# EAGLE design Light Sensor (EAGLE 7.2.0)
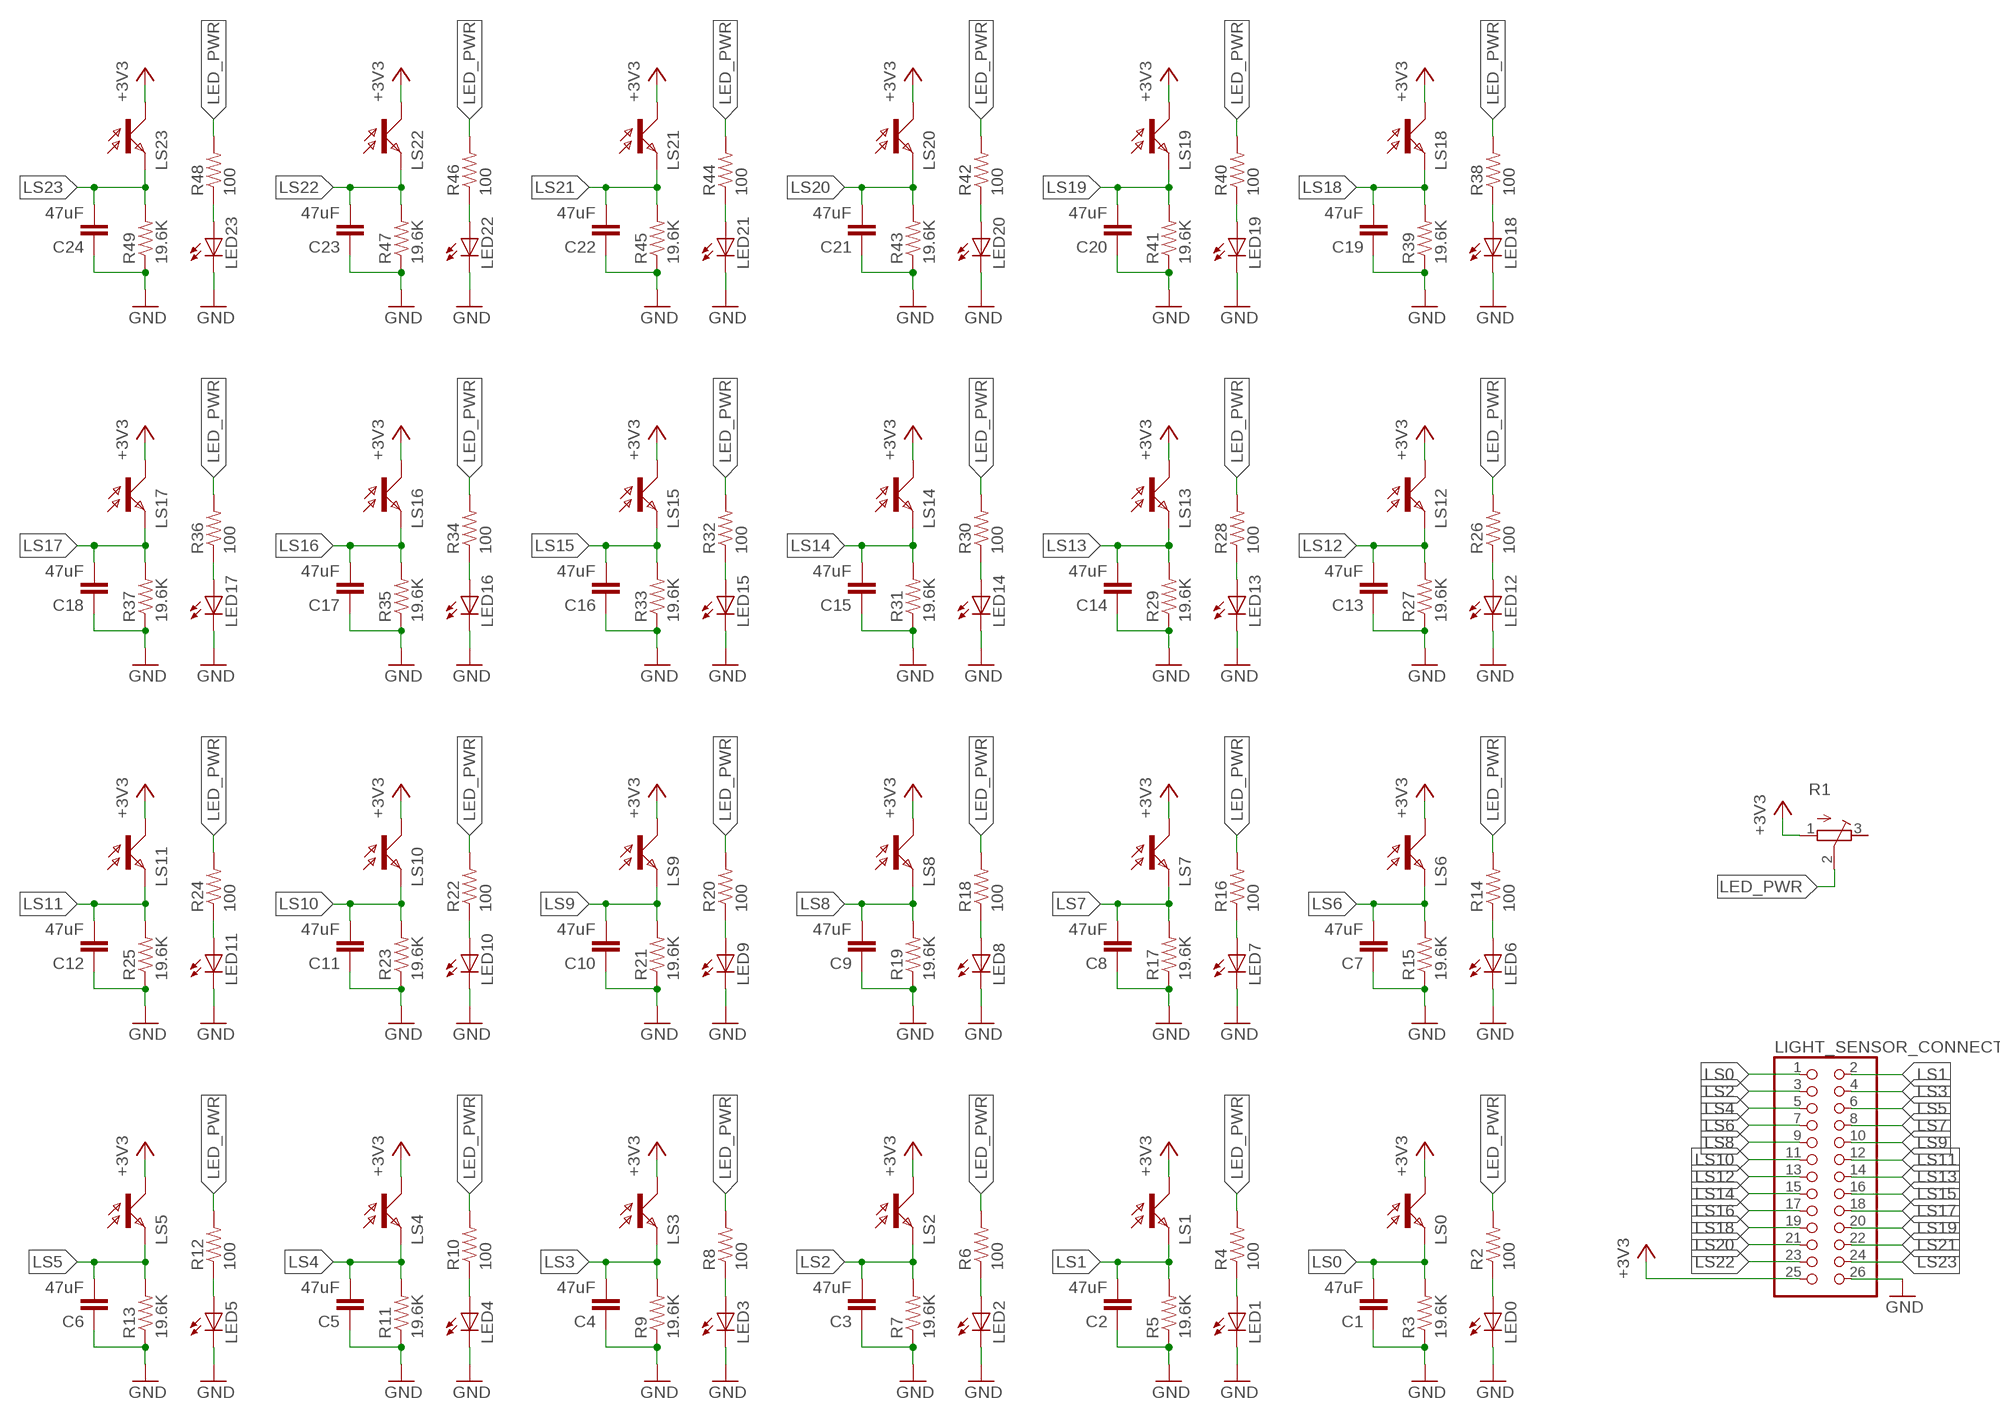
[diagram p0: schematic, sheet 1]

## Parts
C1  47uF  CAP1206  [1206]
C2  47uF  CAP1206  [1206]
C3  47uF  CAP1206  [1206]
C4  47uF  CAP1206  [1206]
C5  47uF  CAP1206  [1206]
C6  47uF  CAP1206  [1206]
C7  47uF  CAP1206  [1206]
C8  47uF  CAP1206  [1206]
C9  47uF  CAP1206  [1206]
C10  47uF  CAP1206  [1206]
C11  47uF  CAP1206  [1206]
C12  47uF  CAP1206  [1206]
C13  47uF  CAP1206  [1206]
C14  47uF  CAP1206  [1206]
C15  47uF  CAP1206  [1206]
C16  47uF  CAP1206  [1206]
C17  47uF  CAP1206  [1206]
C18  47uF  CAP1206  [1206]
C19  47uF  CAP1206  [1206]
C20  47uF  CAP1206  [1206]
C21  47uF  CAP1206  [1206]
C22  47uF  CAP1206  [1206]
C23  47uF  CAP1206  [1206]
C24  47uF  CAP1206  [1206]
LED0  LEDCHIP-LED0603  [CHIP-LED0603]
LED1  LEDCHIP-LED0603  [CHIP-LED0603]
LED2  LEDCHIP-LED0603  [CHIP-LED0603]
LED3  LEDCHIP-LED0603  [CHIP-LED0603]
LED4  LEDCHIP-LED0603  [CHIP-LED0603]
LED5  LEDCHIP-LED0603  [CHIP-LED0603]
LED6  LEDCHIP-LED0603  [CHIP-LED0603]
LED7  LEDCHIP-LED0603  [CHIP-LED0603]
LED8  LEDCHIP-LED0603  [CHIP-LED0603]
LED9  LEDCHIP-LED0603  [CHIP-LED0603]
LED10  LEDCHIP-LED0603  [CHIP-LED0603]
LED11  LEDCHIP-LED0603  [CHIP-LED0603]
LED12  LEDCHIP-LED0603  [CHIP-LED0603]
LED13  LEDCHIP-LED0603  [CHIP-LED0603]
LED14  LEDCHIP-LED0603  [CHIP-LED0603]
LED15  LEDCHIP-LED0603  [CHIP-LED0603]
LED16  LEDCHIP-LED0603  [CHIP-LED0603]
LED17  LEDCHIP-LED0603  [CHIP-LED0603]
LED18  LEDCHIP-LED0603  [CHIP-LED0603]
LED19  LEDCHIP-LED0603  [CHIP-LED0603]
LED20  LEDCHIP-LED0603  [CHIP-LED0603]
LED21  LEDCHIP-LED0603  [CHIP-LED0603]
LED22  LEDCHIP-LED0603  [CHIP-LED0603]
LED23  LEDCHIP-LED0603  [CHIP-LED0603]
LIGHT_SENSOR_CONNECTOR  PINHD-2X13SMT  [2X13_SMT]
LS0  ALS  [SMD]
LS1  ALS  [SMD]
LS2  ALS  [SMD]
LS3  ALS  [SMD]
LS4  ALS  [SMD]
LS5  ALS  [SMD]
LS6  ALS  [SMD]
LS7  ALS  [SMD]
LS8  ALS  [SMD]
LS9  ALS  [SMD]
LS10  ALS  [SMD]
LS11  ALS  [SMD]
LS12  ALS  [SMD]
LS13  ALS  [SMD]
LS14  ALS  [SMD]
LS15  ALS  [SMD]
LS16  ALS  [SMD]
LS17  ALS  [SMD]
LS18  ALS  [SMD]
LS19  ALS  [SMD]
LS20  ALS  [SMD]
LS21  ALS  [SMD]
LS22  ALS  [SMD]
LS23  ALS  [SMD]
R1  R-TRIMM3296W  [RTRIM3296W]
R2  100  RESISTOR0603  [0603-RES]
R3  19.6K  RESISTOR0603  [0603-RES]
R4  100  RESISTOR0603  [0603-RES]
R5  19.6K  RESISTOR0603  [0603-RES]
R6  100  RESISTOR0603  [0603-RES]
R7  19.6K  RESISTOR0603  [0603-RES]
R8  100  RESISTOR0603  [0603-RES]
R9  19.6K  RESISTOR0603  [0603-RES]
R10  100  RESISTOR0603  [0603-RES]
R11  19.6K  RESISTOR0603  [0603-RES]
R12  100  RESISTOR0603  [0603-RES]
R13  19.6K  RESISTOR0603  [0603-RES]
R14  100  RESISTOR0603  [0603-RES]
R15  19.6K  RESISTOR0603  [0603-RES]
R16  100  RESISTOR0603  [0603-RES]
R17  19.6K  RESISTOR0603  [0603-RES]
R18  100  RESISTOR0603  [0603-RES]
R19  19.6K  RESISTOR0603  [0603-RES]
R20  100  RESISTOR0603  [0603-RES]
R21  19.6K  RESISTOR0603  [0603-RES]
R22  100  RESISTOR0603  [0603-RES]
R23  19.6K  RESISTOR0603  [0603-RES]
R24  100  RESISTOR0603  [0603-RES]
R25  19.6K  RESISTOR0603  [0603-RES]
R26  100  RESISTOR0603  [0603-RES]
R27  19.6K  RESISTOR0603  [0603-RES]
R28  100  RESISTOR0603  [0603-RES]
R29  19.6K  RESISTOR0603  [0603-RES]
R30  100  RESISTOR0603  [0603-RES]
R31  19.6K  RESISTOR0603  [0603-RES]
R32  100  RESISTOR0603  [0603-RES]
R33  19.6K  RESISTOR0603  [0603-RES]
R34  100  RESISTOR0603  [0603-RES]
R35  19.6K  RESISTOR0603  [0603-RES]
R36  100  RESISTOR0603  [0603-RES]
R37  19.6K  RESISTOR0603  [0603-RES]
R38  100  RESISTOR0603  [0603-RES]
R39  19.6K  RESISTOR0603  [0603-RES]
R40  100  RESISTOR0603  [0603-RES]
R41  19.6K  RESISTOR0603  [0603-RES]
R42  100  RESISTOR0603  [0603-RES]
R43  19.6K  RESISTOR0603  [0603-RES]
R44  100  RESISTOR0603  [0603-RES]
R45  19.6K  RESISTOR0603  [0603-RES]
R46  100  RESISTOR0603  [0603-RES]
R47  19.6K  RESISTOR0603  [0603-RES]
R48  100  RESISTOR0603  [0603-RES]
R49  19.6K  RESISTOR0603  [0603-RES]

## Nets
+3V3: LIGHT_SENSOR_CONNECTOR.25 LS0.C LS1.C LS2.C LS3.C LS4.C LS5.C LS6.C LS7.C LS8.C LS9.C LS10.C LS11.C LS12.C LS13.C LS14.C LS15.C LS16.C LS17.C LS18.C LS19.C LS20.C LS21.C LS22.C LS23.C R1.1(A)
GND: C1.1 C2.1 C3.1 C4.1 C5.1 C6.1 C7.1 C8.1 C9.1 C10.1 C11.1 C12.1 C13.1 C14.1 C15.1 C16.1 C17.1 C18.1 C19.1 C20.1 C21.1 C22.1 C23.1 C24.1 LED0.C LED1.C LED2.C LED3.C LED4.C LED5.C LED6.C LED7.C LED8.C LED9.C LED10.C LED11.C LED12.C LED13.C LED14.C LED15.C LED16.C LED17.C LED18.C LED19.C LED20.C LED21.C LED22.C LED23.C LIGHT_SENSOR_CONNECTOR.26 R3.1 R5.1 R7.1 R9.1 R11.1 R13.1 R15.1 R17.1 R19.1 R21.1 R23.1 R25.1 R27.1 R29.1 R31.1 R33.1 R35.1 R37.1 R39.1 R41.1 R43.1 R45.1 R47.1 R49.1
LED_PWR: R1.2(S) R2.2 R4.2 R6.2 R8.2 R10.2 R12.2 R14.2 R16.2 R18.2 R20.2 R22.2 R24.2 R26.2 R28.2 R30.2 R32.2 R34.2 R36.2 R38.2 R40.2 R42.2 R44.2 R46.2 R48.2
LS0: C1.2 LIGHT_SENSOR_CONNECTOR.1 LS0.E R3.2
LS1: C2.2 LIGHT_SENSOR_CONNECTOR.2 LS1.E R5.2
LS2: C3.2 LIGHT_SENSOR_CONNECTOR.3 LS2.E R7.2
LS3: C4.2 LIGHT_SENSOR_CONNECTOR.4 LS3.E R9.2
LS4: C5.2 LIGHT_SENSOR_CONNECTOR.5 LS4.E R11.2
LS5: C6.2 LIGHT_SENSOR_CONNECTOR.6 LS5.E R13.2
LS6: C7.2 LIGHT_SENSOR_CONNECTOR.7 LS6.E R15.2
LS7: C8.2 LIGHT_SENSOR_CONNECTOR.8 LS7.E R17.2
LS8: C9.2 LIGHT_SENSOR_CONNECTOR.9 LS8.E R19.2
LS9: C10.2 LIGHT_SENSOR_CONNECTOR.10 LS9.E R21.2
LS10: C11.2 LIGHT_SENSOR_CONNECTOR.11 LS10.E R23.2
LS11: C12.2 LIGHT_SENSOR_CONNECTOR.12 LS11.E R25.2
LS12: C13.2 LIGHT_SENSOR_CONNECTOR.13 LS12.E R27.2
LS13: C14.2 LIGHT_SENSOR_CONNECTOR.14 LS13.E R29.2
LS14: C15.2 LIGHT_SENSOR_CONNECTOR.15 LS14.E R31.2
LS15: C16.2 LIGHT_SENSOR_CONNECTOR.16 LS15.E R33.2
LS16: C17.2 LIGHT_SENSOR_CONNECTOR.17 LS16.E R35.2
LS17: C18.2 LIGHT_SENSOR_CONNECTOR.18 LS17.E R37.2
LS18: C19.2 LIGHT_SENSOR_CONNECTOR.19 LS18.E R39.2
LS19: C20.2 LIGHT_SENSOR_CONNECTOR.20 LS19.E R41.2
LS20: C21.2 LIGHT_SENSOR_CONNECTOR.21 LS20.E R43.2
LS21: C22.2 LIGHT_SENSOR_CONNECTOR.22 LS21.E R45.2
LS22: C23.2 LIGHT_SENSOR_CONNECTOR.23 LS22.E R47.2
LS23: C24.2 LIGHT_SENSOR_CONNECTOR.24 LS23.E R49.2
N$1: LED0.A R2.1
N$2: LED1.A R4.1
N$3: LED2.A R6.1
N$4: LED3.A R8.1
N$5: LED4.A R10.1
N$6: LED5.A R12.1
N$7: LED6.A R14.1
N$8: LED7.A R16.1
N$9: LED8.A R18.1
N$10: LED9.A R20.1
N$11: LED10.A R22.1
N$12: LED11.A R24.1
N$13: LED12.A R26.1
N$14: LED13.A R28.1
N$15: LED14.A R30.1
N$16: LED15.A R32.1
N$17: LED16.A R34.1
N$18: LED17.A R36.1
N$19: LED18.A R38.1
N$20: LED19.A R40.1
N$21: LED20.A R42.1
N$22: LED21.A R44.1
N$23: LED22.A R46.1
N$24: LED23.A R48.1
Unconnected: R1.3(E)

## Library data of the parts
C1-C24 = SparkFun-Capacitors:CAP: Capacitor Standard 0603 ceramic capacitor, and 0.1" leaded capacitor.
LED0 LED1-LED23 = adafruit:LED: LED OSRAM: - CHIPLED LG R971, LG N971, LY N971, LG Q971, LY Q971, LO R971, LY R971 LH N974, LH R974 LS Q976, LO Q976, LY Q976 LO Q996 - Hyper CHIPLED LW Q18S LB Q993, LB Q99A, LB R99A - SideLED LS A670, LO A670, LY A670, LG A670, LP A670 LB A673, LV A673, LT A673, LW A673 LH A674 LY A675 LS A676, LA A676, LO A676, LY A676, LW A676 LS A679, LY A679, LG A679 - Hyper Micro SIDELED® LS Y876, LA Y876, LO Y876, LY Y876 LT Y87S - SmartLED LW L88C, LW L88S LB L89C, LB L89S, LG L890 LS L89K, LO L89K, LY L89K LS L896, LA L896, LO L896, LY L896 - TOPLED LS T670, LO T670, LY T670, LG T670, LP T670 LSG T670, LSP T670, LSY T670, LOP T670, LYG T670 LG T671, LOG T671, LSG T671 LB T673, LV T673, LT T673, LW T673 LH T674 LS T676, LA T676, LO T676, LY T676, LB T676, LH T676, LSB T676, LW T676 LB T67C, LV T67C, LT T67C, LS T67K, LO T67K, LY T67K, LW E67C LS E67B, LA E67B, LO E67B, LY E67B, LB E67C, LV E67C, LT E67C LW T67C LS T679, LY T679, LG T679 LS T770, LO T770, LY T770, LG T770, LP T770 LB T773, LV T773, LT T773, LW T773 LH T774 LS E675, LA E675, LY E675, LS T675 LS T776, LA T776, LO T776, LY T776, LB T776 LHGB T686 LT T68C, LB T68C - Hyper Mini TOPLED® LB M676 - Mini TOPLED Santana® LG M470 LS M47K, LO M47K, LY M47K Source: http://www.osram.convergy.de/
LIGHT_SENSOR_CONNECTOR = pinhead+:PINHD-2X13: PIN HEADER
LS0 LS1-LS23 = phototransitor-ALS-PT19-315CL177TR8:ALS
R1 = rcl:R-TRIMM: Trimm resistor
R2-R49 = SparkFun-Resistors:RESISTOR: Resistor Basic schematic elements and footprints for 0603, 1206, and PTH resistors.

## Board
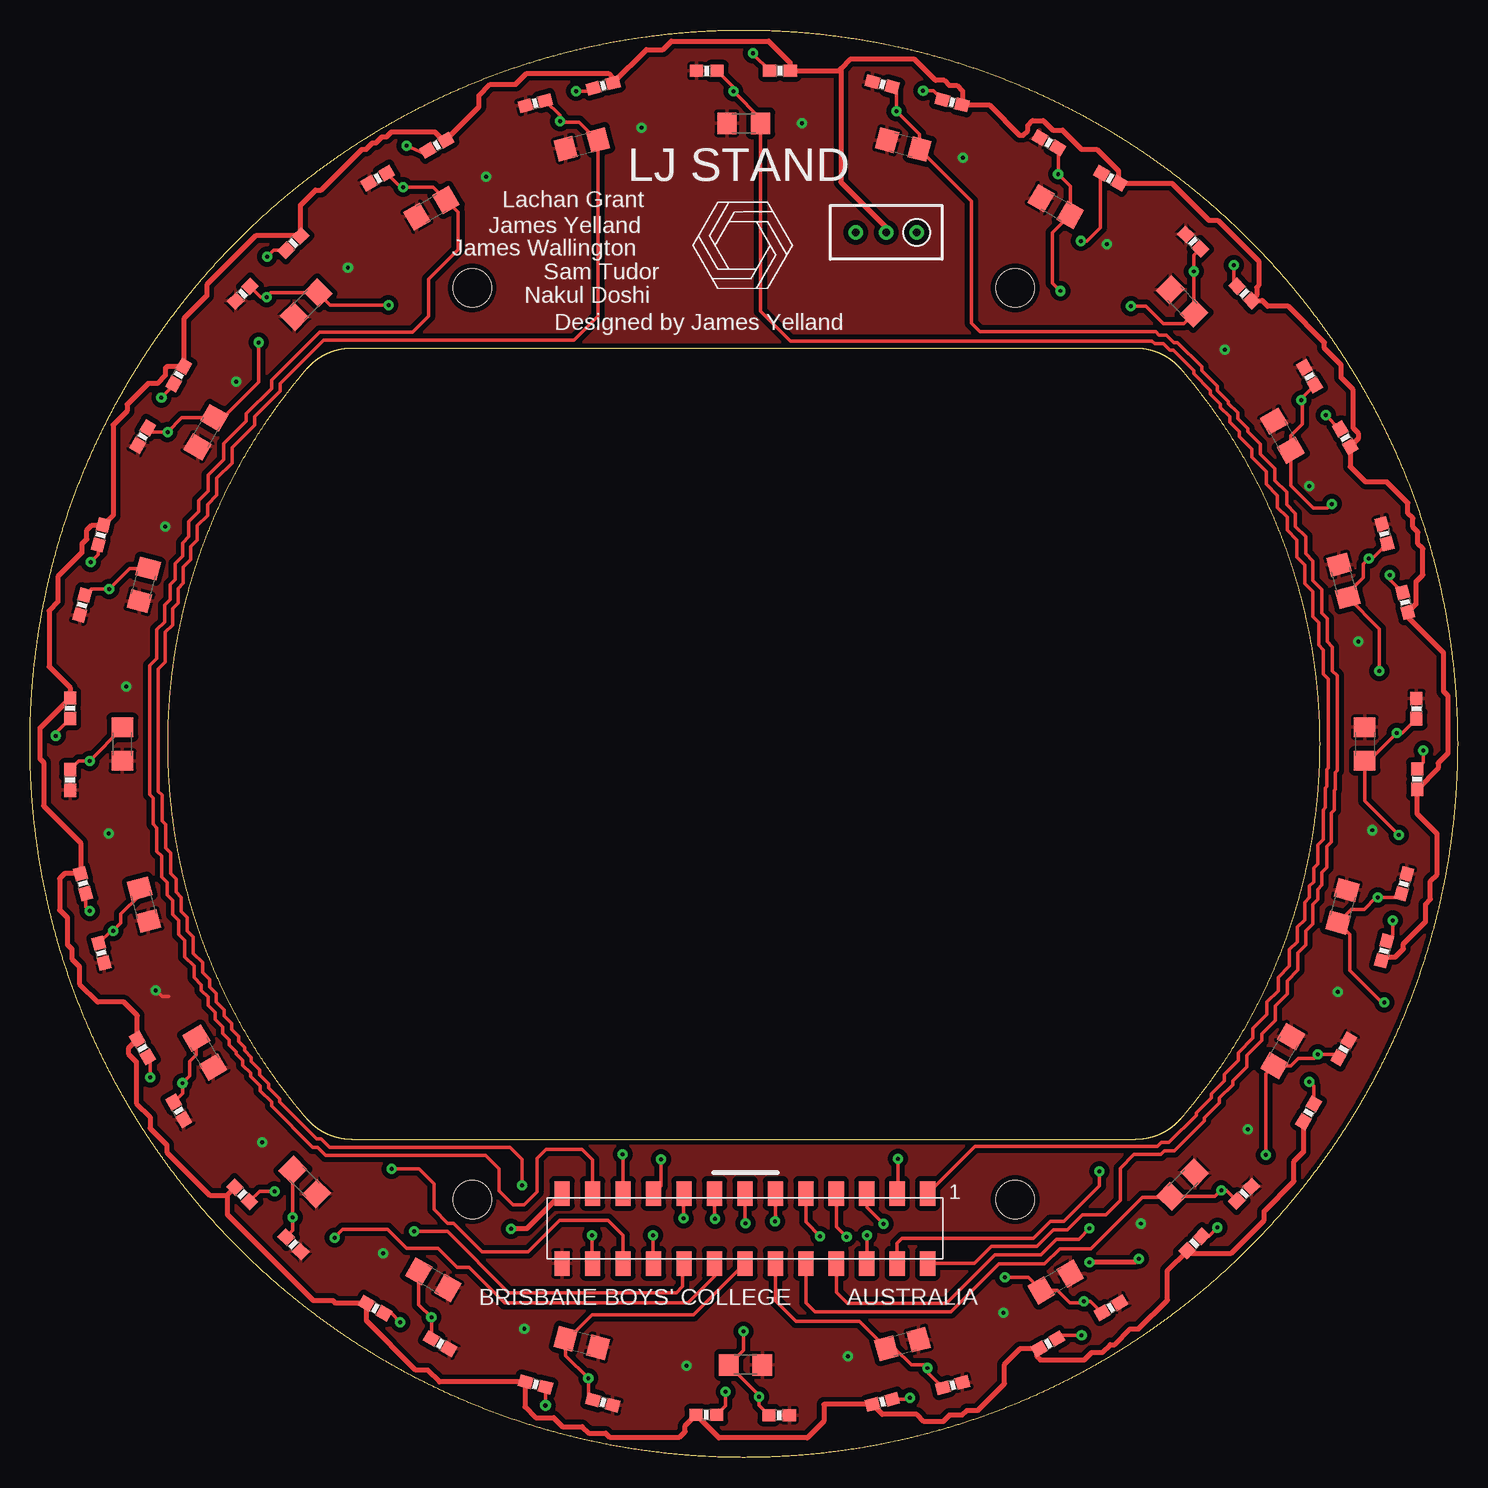
[diagram p1: board, top side]
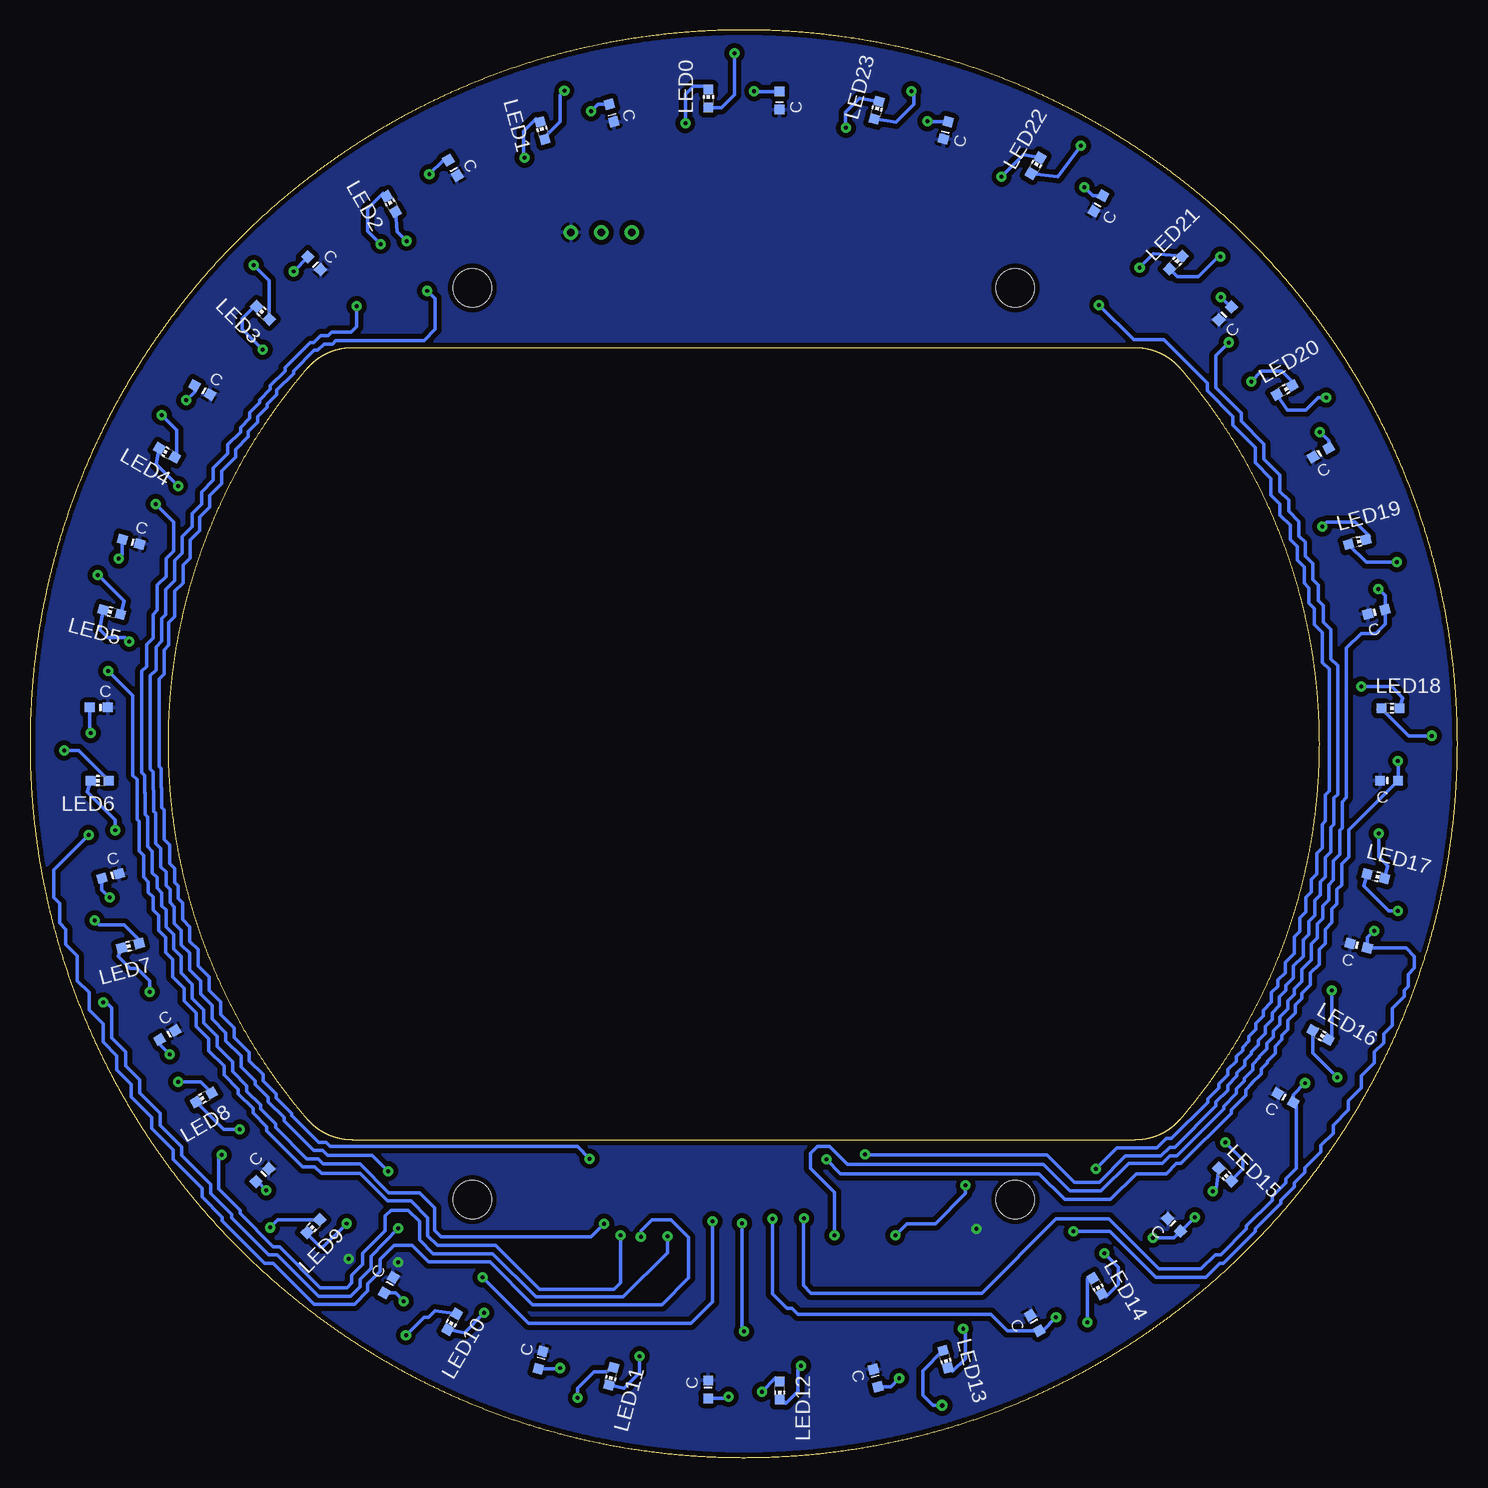
[diagram p2: board, bottom side, seen from below]

Size 119 x 119 mm. Coordinates in mm from the lower left corner, seen from the top.
Outline: 7085 segments
Copper layers (1*16): Top 0.035mm / dielectric 1.5mm / Bottom 0.035mm
Design rules "SparkFun *": minimum track width 8mil, minimum drill 12mil, track to track 8mil, track to pad 8mil, pad to pad 8mil, via to via 8mil, smd to smd 8mil, copper to edge 10mil, drill to drill 8mil, minimum pad ring 12mil, minimum via ring 10mil, stop-mask expansion 4mil, vias tented up to drill 25mil, thermal gap 10mil
Holes 3.2 mm at 36.86,97.5 82.13,97.5 82.13,21.5 36.87,21.49

### Footprints (pad centres in the part's own frame; a part is rotated, then mirrored left to right if it is on the bottom)
1206 = smd 1.6 x 1.8: 1 -1.4,0; 2 1.4,0
CHIP-LED0603 = smd 0.8 x 0.8: A 0,-0.75; C 0,0.75
2X13_SMT = smd 1.27 x 2.032: 1 -15.24,-2.921; 2 -15.24,2.921; 3 -12.7,-2.921; 4 -12.7,2.921; 5 -10.16,-2.921; 6 -10.16,2.921; 7 -7.62,-2.921; 8 -7.62,2.921; 9 -5.08,-2.921; 10 -5.08,2.921; 11 -2.54,-2.921; 12 -2.54,2.921; 13 0,-2.921; 14 0,2.921; 15 2.54,-2.921; 16 2.54,2.921; 17 5.08,-2.921; 18 5.08,2.921; 19 7.62,-2.921; 20 7.62,2.921; 21 10.16,-2.921; 22 10.16,2.921; 23 12.7,-2.921; 24 12.7,2.921; 25 15.24,-2.921; 26 15.24,2.921
SMD = smd 0.8 x 0.8: C -0.75,0; E 0.75,0
RTRIM3296W = drill 0.61: 1 0,-2.54; 2 0,0; 3 0,2.54
0603-RES = smd 1.1 x 1: 1 -0.85,0; 2 0.85,0

### Placement (x,y rotation side)
C1  59.5,111.22 0 top
C2  72.81,109.44 345 top
C3  85.51,104.28 330 top
C4  96.05,96.36 315 top
C5  104.4,85.18 300 top
C6  109.48,73.07 285 top
C7  111.26,59.48 270 top
C8  109.41,45.94 255 top
C9  104.43,33.88 240 top
C10  96.1,22.75 225 top
C11  85.51,14.62 210 top
C12  72.73,9.47 195 top
C13  59.65,7.71 180 top
C14  46.01,9.54 165 top
C15  33.61,14.83 150 top
C16  22.89,22.98 135 top
C17  14.56,33.75 120 top
C18  9.51,46.07 105 top
C19  7.71,59.48 90 top
C20  9.48,72.74 75 top
C21  14.66,85.46 60 top
C22  23.02,96.11 45 top
C23  33.46,104.13 30 top
C24  46.01,109.47 15 top
LED0  62.44,113.28 0 bottom
LED1  76.29,110.61 15 bottom
LED2  88.91,104.49 30 bottom
LED3  99.58,95.42 45 bottom
LED4  107.58,83.76 60 bottom
LED5  112.18,70.48 75 bottom
LED6  113.19,56.43 90 bottom
LED7  110.63,42.66 105 bottom
LED8  104.5,30.01 120 bottom
LED9  95.39,19.3 135 bottom
LED10  83.8,11.32 150 bottom
LED11  70.54,6.77 165 bottom
LED12  56.5,5.58 180 bottom
LED13  42.68,8.2 195 bottom
LED14  30.03,14.29 210 bottom
LED15  19.36,23.59 225 bottom
LED16  11.41,35.22 240 bottom
LED17  6.82,48.46 255 bottom
LED18  5.6,62.45 270 bottom
LED19  8.37,76.32 285 bottom
LED20  14.41,88.99 300 bottom
LED21  23.48,99.61 315 bottom
LED22  35.16,107.69 330 bottom
LED23  48.42,112.31 345 bottom
LIGHT_SENSOR_CONNECTOR  59.6,19.09 180 top
LS0  56.52,113.12 90 bottom
LS1  70.52,112.08 105 bottom
LS2  83.75,107.51 120 bottom
LS3  95.31,99.56 135 bottom
LS4  104.63,88.99 150 bottom
LS5  110.58,76.34 165 bottom
LS6  113.27,62.53 180 bottom
LS7  112.28,48.48 195 bottom
LS8  107.55,35.22 210 bottom
LS9  99.63,23.54 225 bottom
LS10  89.09,14.37 240 bottom
LS11  76.44,8.12 255 bottom
LS12  62.47,5.68 270 bottom
LS13  48.5,6.62 285 bottom
LS14  35.24,11.22 300 bottom
LS15  23.63,19.4 315 bottom
LS16  14.33,29.96 330 bottom
LS17  8.24,42.66 345 bottom
LS18  5.7,56.43 0 bottom
LS19  6.77,70.5 15 bottom
LS20  11.39,83.79 30 bottom
LS21  19.36,95.37 45 bottom
LS22  29.93,104.54 60 bottom
LS23  42.66,110.63 75 bottom
R1  71.38,102.13 90 top
R2  62.52,115.61 0 top
R3  56.42,115.59 0 top
R4  76.87,112.97 345 top
R5  71.05,114.47 345 top
R6  90.05,106.65 330 top
R7  84.92,109.59 330 top
R8  101.23,97.05 315 top
R9  96.96,101.36 315 top
R10  109.64,85.01 300 top
R11  106.66,90.14 300 top
R12  114.64,71.29 285 top
R13  112.91,77 285 top
R14  115.63,56.56 270 top
R15  115.58,62.43 270 top
R16  112.89,42.23 255 top
R17  114.54,47.82 255 top
R18  106.59,28.74 240 top
R19  109.51,34.05 240 top
R20  97.06,17.85 225 top
R21  101.2,21.99 225 top
R22  84.87,9.49 210 top
R23  90.1,12.49 210 top
R24  71.05,4.64 195 top
R25  76.92,6.04 195 top
R26  56.37,3.55 180 top
R27  62.44,3.52 180 top
R28  42.15,6.09 165 top
R29  47.76,4.59 165 top
R30  28.79,12.44 150 top
R31  34.2,9.49 150 top
R32  17.69,21.94 135 top
R33  21.95,17.77 135 top
R34  9.38,34.13 120 top
R35  12.4,28.9 120 top
R36  4.43,47.85 105 top
R37  5.95,42.05 105 top
R38  3.34,62.45 90 top
R39  3.34,56.48 90 top
R40  5.9,76.9 75 top
R41  4.35,71.06 75 top
R42  12.4,90.24 60 top
R43  9.41,85.11 60 top
R44  21.95,101.24 45 top
R45  17.74,97.02 45 top
R46  33.92,109.39 30 top
R47  28.99,106.65 30 top
R48  47.79,114.37 15 top
R49  42.12,112.9 15 top

### Tracks (layer width: path | path; a pad name or v marks a point on that pad's centre or on a via)
+3V3  (via drill 0.33)
  Top 0.406: 44.36,22.52 LIGHT_SENSOR_CONNECTOR.25 41.41,19.07 v40.12,19.07 | v92.44,16.58 92.14,16.27 v88.3,16.27
  pour Bottom (isolate 0.406): -19.2,144.2 -9.2,134.2 -9.2,-0.8 0.8,-10.8 105.8,-10.8 130.8,14.2 130.8,134.2 120.8,144.2
GND  (via drill 0.33)
  Top 0.305: v10.47,38.96 11.01,38.42 11.57,38.42
  Bottom 0.305: v64.37,111.22 64.37,113.63 63.69,114.32 62.45,114.32 LED0.C | LED23.C 49.87,113.32 51.04,112.16 51.04,110.89 v50.99,110.84 | LED22.C 36.18,108.6 v38.01,106.77 | LED21.C 25.35,100.35 v26.5,99.2 | LED20.C 13.59,89.52 14.64,90.57 16.34,90.57 v17.21,89.7 | LED19.C 7.35,76.8 8.52,77.97 10.88,77.97 v11.26,77.59 | LED18.C 4.55,63.31 5.5,64.25 8.01,64.25 v8.04,64.28 | LED17.C 5.8,49.32 6.56,50.08 v6.56,52.01 | LED15.C 18.62,23.37 17.92,24.07 17.92,24.83 v19.36,26.28 | LED14.C 29.32,13.38 28.25,14.44 28.25,15.84 v29.45,17.04 | LED13.C 42.1,7.18 41.03,8.25 41.03,10.56 v41.21,10.74 | LED12.C 55.97,4.53 54.97,5.53 54.97,7.38 v54.72,7.64 | LED10.C 82.78,10.41 v81.14,12.06 | LED9.C 95.81,18.55 94.8,17.54 94.55,17.54 v92.59,19.5 | LED7.C 111.64,41.77 110.63,40.76 110.04,40.76 109.03,39.74 v109.03,38.83 | LED6.C 114.24,55.47 111.9,53.13 v111.9,52.29 | LED5.C 113.19,69.03 112.51,68.34 111.06,68.34 v110.73,68.01 | LED4.C 108.49,82.82 v106.66,80.99 | LED3.C 100.32,95.95 101.33,94.94 101.33,94.07 v99.6,92.35 | LED2.C 89.55,105.4 90.84,104.11 90.84,102.23 v89.77,101.16 | LED1.C 76.8,111.62 77.86,110.56 77.86,108.42 v77.78,108.35 | LED11.C 69.48,5.76 68.18,7.05 v68.18,8.42 | LED16.C 10.47,34.73 v10.47,38.96 | v101.51,27.35 102.86,27.35 LED8.C
  pour Top (isolate 0.406): -17.47,118.61 -26.89,109.19 -26.89,4.46 -0.5,-21.93 117.59,-21.93 137.58,-1.94 137.58,116.25 119.95,133.88 3.56,133.88 -11.7,118.61
LED_PWR
  Top 0.406: R16.2 112.95,41.7 113.78,41.7 114.49,42.41 114.49,42.82 116.34,44.67 116.34,46.12 116.75,46.52 116.75,48.05 117.31,48.61 117.31,51.99 115.63,53.66 R14.2 117.38,57.46 117.38,57.88 118.2,58.69 118.2,63.52 117.84,63.87 117.84,67.07 114.86,70.05 R12.2 115.53,71.14 115.53,72.99 116.11,73.58 116.11,75.76 115.71,76.17 115.71,77.13 115.27,77.56 115.27,78.3 114.87,78.71 114.87,79.57 113.12,81.32 111.34,81.32 110.06,82.6 R10.2 110.73,84.94 110.73,85.39 110.3,85.82 110.3,89.02 109.31,90.01 109.31,91.08 107.91,92.47 107.91,92.96 104.89,95.98 103.18,95.98 102.72,96.44 R8.2 102.27,96.88 102.27,97.55 102.42,97.71 102.42,99.74 99.02,103.14 98.28,103.14 95.2,106.22 R6.2 90.74,106.27 90.74,107.26 88.93,109.06 87.66,109.06 86.06,110.66 85.25,110.66 84.46,111.45 83.58,111.45 83.17,111.04 83.17,110.61 82.79,110.23 82.48,110.23 79.96,112.75 R4.2 77.73,112.79 77.73,113.91 77.25,114.39 76.62,114.39 76.21,114.8 75.5,114.8 73.75,116.55 68.36,116.55 67.6,115.79 | R18.2 106.16,25.47 105.37,24.68 105.37,23.03 102.88,20.54 102.88,19.78 100.14,17.04 96.67,17.04 R20.2 | R20.2 96.46,16.74 | 16.86,22.54 R32.2 16.44,21.89 16.44,21.86 | 16.44,21.86 16.44,20.26 23.61,13.1 25.25,13.1 25.49,12.86 R30.2 28.05,11.4 32.17,7.28 33.16,7.28 34.13,6.31 R28.2 41.26,6.24 41.26,4.21 42.15,3.32 43.65,3.32 44.38,2.58 46.03,2.58 46.59,2.02 47.99,2.02 48.32,1.69 54.14,1.69 54.61,2.16 54.61,2.63 R26.2 57.43,1.64 64.8,1.64 66.18,3.02 66.18,4.42 R24.2 71.05,3.6 73.92,3.6 74.53,2.99 76.11,2.99 76.64,3.52 77.71,3.52 78.09,3.9 78.98,3.9 81.24,6.16 81.24,7.76 82.54,9.07 R22.2 83.96,8.89 83.96,8.4 84.21,8.15 87.89,8.15 88.5,8.75 89.39,8.75 90.05,9.42 90.43,9.42 91.73,10.71 92.41,10.71 94.83,13.12 94.83,15.61 R20.2
  Top 0.406: R1.2 71.38,102.54 67.6,106.32 67.6,115.79 | 67.6,115.79 67.42,115.61 R2.2 63.37,116.29 61.58,118.08 53.48,118.08 52.77,117.37 51.38,117.37 R48.2 48.61,114.99 48.22,115.38 41.41,115.38 40.5,114.47 38.36,114.47 37.43,113.54 37.43,112.59 R46.2 34.43,109.81 33.74,110.51 30.13,110.51 29.73,110.1 29.35,110.1 28.84,109.59 28.56,109.59 28.03,109.06 27.67,109.06 24.27,105.66 23.81,105.66 22.56,104.4 R44.2 18.83,101.85 14.74,97.76 14.74,96.84 12.83,94.93 R42.2 11.46,90.97 11.31,90.82 11.31,90.21 10.63,89.53 9.84,89.53 8.09,87.77 8.09,87.24 6.92,86.07 6.92,78.52 R40.2 5.15,77.72 4.73,77.31 4.73,76.55 4.33,76.14 4.33,75.43 2.32,73.42 2.32,71.34 1.58,70.6 1.58,65.93 3.34,64.18 R38.2 0.82,60.79 0.82,58.26 1.13,57.95 1.13,54.32 4.21,51.24 R36.2 2.89,48.67 2.47,48.25 2.47,45.64 3.11,45 3.11,42.77 3.49,42.38 3.49,41.57 4.12,40.94 4.12,39.49 5.65,37.96 7.83,37.96 8.96,36.84 R34.2 8.24,34.15 8.24,33.62 8.87,32.99 8.87,29.53 10.02,28.39 10.02,27.45 11.41,26.05 11.41,25.44 15,21.86 16.44,21.86
LS0  (via drill 0.33)
  Top 0.305: R3.2 58.63,114.23 v58.63,113.89 60.9,111.62 C1.2 60.9,95.57 63.38,93.08 93.53,93.08 93.76,92.85 94.47,92.85 95.03,92.3 95.31,92.3 97.01,90.59 97.01,90.34 98.41,88.94 98.41,88.66 99.25,87.82 99.25,87.52 100.01,86.76 100.01,86.33 100.8,85.54 100.8,85.11 101.84,84.07 101.84,83.41 103.06,82.19 103.06,81.14 104,80.2 104,79.19 104.81,78.38 104.81,77.31 105.62,76.5 105.62,75.05 106.26,74.41 106.26,72.86 106.94,72.18 106.94,70.1 107.43,69.61 107.43,67.73 107.83,67.33 107.83,65.32 108.24,64.91 108.24,57.5 108.11,57.37 108.11,55.95 107.98,55.82 107.98,54.17 107.81,53.99 107.81,51.5 107.38,51.07 107.38,49.5 107.02,49.14 107.02,48 106.66,47.64 106.66,46.68 106.26,46.27 106.26,44.82 105.65,44.21 105.65,42.99 104.99,42.33 104.99,40.96 104.05,40.02 104.05,38.9 103.11,37.96 103.11,36.95 101.94,35.78 101.94,34.97 100.72,33.75 100.72,33.09 99.58,31.94 99.58,31.41 98.46,30.29 98.46,29.96 97.22,28.72 97.22,28.54 94.93,26.26 94.29,26.26 93.99,25.95 78.77,25.95 LIGHT_SENSOR_CONNECTOR.1
  Bottom 0.305: 56.56,113.83 LS0.E 58.62,113.87 v58.63,113.89
LS1  (via drill 0.33)
  Top 0.305: R5.2 72.22,113.9 v72.22,112.23 74.16,110.3 C2.2 78.5,104.74 78.5,94.56 79.21,93.84 93.84,93.84 94.12,93.57 94.73,93.57 95.34,92.96 95.67,92.96 97.7,90.92 97.7,90.62 98.99,89.32 98.99,88.94 99.91,88.03 99.91,87.85 100.67,87.09 100.67,86.61 101.51,85.77 101.51,85.51 102.55,84.47 102.55,83.66 103.77,82.44 103.77,81.45 104.76,80.46 104.76,79.44 105.5,78.71 105.5,77.61 106.33,76.78 106.33,75.35 106.94,74.74 106.94,73.09 107.68,72.36 107.68,70.4 108.14,69.94 108.14,68.01 108.57,67.58 108.57,65.57 108.98,65.17 108.98,57.27 108.82,57.12 108.82,55.69 108.75,55.62 108.75,53.99 108.49,53.74 108.49,51.3 108.11,50.92 108.11,49.19 107.71,48.79 107.71,47.72 107.35,47.36 107.35,46.52 106.94,46.12 106.94,44.49 106.33,43.88 106.33,42.71 105.7,42.08 105.7,40.63 104.81,39.74 104.81,38.63 103.82,37.63 103.82,36.44 102.68,35.3 102.68,34.76 101.43,33.52 101.43,32.55 100.26,31.39 100.26,31.08 99.15,29.96 99.15,29.56 97.9,28.31 97.9,28.06 95.39,25.54 94.55,25.54 94.27,25.26 92.03,25.26 90.89,24.12 90.89,21.45 89.67,20.24 87.74,20.24 86.47,18.97 85.33,18.97 83.96,17.59 80.15,17.59 78.72,16.17 LIGHT_SENSOR_CONNECTOR.2
  Bottom 0.305: LS1.E 71.65,112.81 v72.22,112.23
LS2  (via drill 0.33)
  Top 0.305: R7.2 85.71,109.12 v85.71,106.98 86.72,105.97 C3.2 85.23,102.09 85.23,97.91 v85.89,97.25 | v72.35,24.91 72.35,22.06 LIGHT_SENSOR_CONNECTOR.3
  Bottom 0.305: LS2.E 84.53,108.16 v85.71,106.98 | v85.89,97.25 85.23,96.59 85.23,94.05 86.17,93.11 93.51,93.11 93.79,92.83 94.47,92.83 95.01,92.3 95.31,92.3 97.04,90.57 97.04,90.36 98.43,88.97 98.43,88.61 99.25,87.8 99.25,87.55 100.01,86.78 100.01,86.33 100.8,85.54 100.8,85.11 101.86,84.04 101.86,83.38 103.03,82.21 103.03,81.2 104.02,80.2 104.02,79.21 104.84,78.4 104.84,77.28 105.65,76.47 105.65,75 106.23,74.41 106.23,72.92 106.92,72.23 106.92,70.1 107.43,69.59 107.43,67.71 107.83,67.3 107.83,65.32 108.24,64.91 108.24,57.6 108.06,57.42 108.06,55.85 108.01,55.8 108.01,54.17 107.83,53.99 107.83,51.5 107.38,51.05 107.38,49.52 106.94,49.09 106.94,47.92 106.66,47.64 106.66,46.6 106.28,46.22 106.28,44.85 105.67,44.24 105.67,43.02 104.99,42.33 104.99,40.99 104.05,40.05 104.05,38.93 103.11,37.99 103.11,36.95 101.96,35.81 101.96,35.02 100.72,33.77 100.72,33.06 99.58,31.92 99.58,31.41 98.49,30.32 98.49,29.99 97.19,28.69 97.19,28.52 94.95,26.28 94.32,26.28 93.96,25.93 73.36,25.93 v72.35,24.91
LS3  (via drill 0.33)
  Top 0.305: R9.2 97.01,100.21 v97.01,98.87 97.04,98.85 C4.2 96.17,94.51 94.5,94.51 93.02,95.98 v91.78,95.98 | v89.14,23.87 89.14,22.65 86.19,19.7 85.05,19.7 83.63,18.28 72.68,18.28 72.27,17.87 72.27,16.2 LIGHT_SENSOR_CONNECTOR.4
  Bottom 0.305: LS3.E 95.84,100.05 v97.01,98.87 | v91.78,95.98 91.78,94.28 92.24,93.82 93.84,93.82 94.14,93.51 94.78,93.51 95.34,92.96 95.64,92.96 97.75,90.85 97.75,90.57 98.97,89.35 98.97,89.04 99.86,88.16 99.86,87.93 100.69,87.09 100.69,86.63 101.46,85.87 101.46,85.49 102.52,84.42 102.52,83.68 103.72,82.49 103.72,81.47 104.71,80.48 104.71,79.47 105.5,78.68 105.5,77.59 106.31,76.78 106.31,75.38 106.92,74.77 106.92,73.12 107.68,72.36 107.68,70.27 108.01,69.94 108.01,68.06 108.49,67.58 108.49,65.65 108.98,65.17 108.98,57.4 108.72,57.14 108.72,55.67 108.67,55.62 108.67,53.87 108.52,53.71 108.52,51.2 108.09,50.77 108.09,49.24 107.65,48.81 107.65,47.69 107.32,47.36 107.32,46.27 106.97,45.91 106.97,44.52 106.38,43.93 106.38,42.74 105.7,42.05 105.7,40.66 104.78,39.74 104.78,38.65 103.82,37.69 103.82,36.54 102.68,35.4 102.68,34.74 101.41,33.47 101.41,32.58 100.24,31.41 100.24,31.11 99.15,30.01 99.15,29.66 97.82,28.34 97.82,28.06 95.36,25.59 94.6,25.59 94.19,25.19 90.46,25.19 v89.14,23.87
LS4  (via drill 0.33)
  Top 0.305: R11.2 105.98,88.29 v105.98,88.13 106.05,88.05 106.05,86.15 105.1,85.2 C5.2 105.1,81.03 106.99,79.14 108.16,79.14 v108.52,79.49 | v71.15,19.47 69.76,20.87 LIGHT_SENSOR_CONNECTOR.5
  Bottom 0.305: LS4.E 105.28,88.83 v105.98,88.13 | v108.52,79.49 107.02,78 107.02,75.58 107.65,74.95 107.65,73.45 108.39,72.71 108.39,70.63 108.75,70.27 108.75,68.29 109.28,67.76 109.28,65.96 109.69,65.55 109.69,57.09 109.43,56.84 109.43,55.41 109.41,55.39 109.41,53.61 109.2,53.41 109.2,50.94 108.8,50.54 108.8,48.73 108.42,48.35 108.42,47.46 108.01,47.06 108.01,45.99 107.65,45.64 107.65,44.24 107.02,43.6 107.02,42.38 106.41,41.77 106.41,40.38 105.47,39.44 105.47,38.27 104.5,37.3 104.5,36.21 103.41,35.12 103.41,34.28 102.12,32.99 102.12,32.17 100.92,30.98 100.92,30.52 99.78,29.38 99.78,29.05 98.54,27.8 98.54,27.53 95.92,24.91 94.98,24.91 94.55,24.48 91.5,24.48 89.09,22.06 86.52,22.06 85.25,20.79 85.25,18.94 84.72,18.41 72.22,18.41 v71.15,19.47
LS5  (via drill 0.33)
  Top 0.305: R13.2 111.9,74.95 v111.62,74.95 111.13,74.46 111.13,73.35 109.85,72.06 C6.2 112.48,69.08 v112.48,65.57 | v69.78,18.51 69.76,18.48 LIGHT_SENSOR_CONNECTOR.6
  Bottom 0.305: LS5.E 111.3,75.26 v111.62,74.95 | v112.48,65.57 110.42,63.52 110.42,56.86 110.07,56.51 110.07,53.2 109.89,53.03 109.89,50.56 109.53,50.21 109.53,48.38 109.13,47.97 109.13,47.11 108.75,46.73 108.75,45.64 108.29,45.18 108.29,43.93 107.71,43.35 107.71,42.1 107.12,41.52 107.12,40.07 107.1,40.07 106.13,39.11 106.13,38.07 105.14,37.08 105.14,35.93 104.1,34.89 104.1,33.9 102.83,32.63 102.83,31.89 101.63,30.7 101.63,30.32 100.42,29.1 100.42,28.72 99.27,27.58 99.27,27.25 96.28,24.25 95.26,24.25 94.7,23.69 91.5,23.69 89.19,21.38 87.23,21.38 85.84,19.98 85.84,18.48 85.02,17.67 80.17,17.67 76.54,14.04 70.32,14.04 69.78,14.57 v69.78,18.51
LS6  (via drill 0.33)
  Top 0.305: R15.2 114.4,60.39 v113.93,60.39 111.61,58.08 C7.2 111.26,54.73 v114.11,51.88 | v68.08,18.38 67.22,19.24 LIGHT_SENSOR_CONNECTOR.7
  Bottom 0.305: LS6.E 114.02,60.48 v113.93,60.39 | v68.08,18.38 68.08,18.91 67.17,19.83 65.57,19.83 64.09,18.36 64.09,14.98 66.33,12.74 77.1,12.74 80.65,16.3 85.79,16.3 87.16,17.67 88.63,17.67 89.8,16.5 89.8,15.51 90.84,14.47 90.84,13.89 91.96,12.77 95.31,12.77 98.71,16.17 99.42,16.17 102.98,19.73 102.98,20.03 104.66,21.71 104.66,22.45 107.07,24.86 107.07,25.65 108.87,27.45 108.87,28.36 110.58,30.07 110.58,31.11 111.77,32.3 111.77,33.49 112.91,34.64 112.91,36.16 114.08,37.33 114.08,38.75 115.07,39.74 115.07,41.83 116.01,42.77 116.01,44.04 116.52,44.54 116.52,46.17 117.03,46.68 117.03,48.96 v114.11,51.88
LS7  (via drill 0.33)
  Top 0.305: R17.2 114,46.68 v112.35,46.68 112.2,46.68 111.21,45.69 110.14,45.69 C8.2 110.02,43.62 110.02,40.61 112.68,37.94 v112.89,37.94 | LIGHT_SENSOR_CONNECTOR.8 67.22,13.78 68.13,12.87 76.39,12.87 80.43,16.91 84.29,16.91 85.58,18.2 87.44,18.2 v88.33,19.09
  Bottom 0.305: LS7.E 113,47.33 v112.35,46.68 | v88.33,19.09 90.56,16.78 90.56,15.79 91.5,14.85 91.5,14.22 92.26,13.45 94.95,13.45 98.41,16.91 99.09,16.91 102.17,19.98 102.17,20.26 103.95,22.04 103.95,22.78 106.36,25.19 106.36,25.9 108.16,27.7 108.16,28.69 109.86,30.4 109.86,31.46 111.03,32.63 111.03,33.8 112.2,34.97 112.2,37.48 112.66,37.94 v112.89,37.94
LS8  (via drill 0.33)
  Top 0.305: R19.2 108.8,33.6 v107.35,33.6 107.04,33.29 105.72,33.29 105.1,32.66 C9.2 | C9.2 103.82,32.57 | v65.87,18.43 64.68,19.63 LIGHT_SENSOR_CONNECTOR.9 | v103.03,25.21 103.03,31.97 C9.2
  Bottom 0.305: LS8.E 108.2,34.45 v107.35,33.6 | v65.87,18.43 65.87,17.06 69.55,13.38 76.82,13.38 80.43,16.98 85.38,16.98 86.52,18.13 86.52,19.68 87.46,20.62 88.91,20.62 89.39,20.13 89.39,18.91 91.27,17.04 91.27,16.12 92.19,15.21 92.19,14.55 92.57,14.16 94.8,14.16 98.21,17.57 98.71,17.57 101.48,20.34 101.48,20.62 103.26,22.39 103.26,24.99 v103.03,25.21
LS9  (via drill 0.33)
  Top 0.305: R21.2 99.72,22.27 v99.3,22.27 98.79,21.76 95.61,21.76 | C10.2 95.61,21.76 | LIGHT_SENSOR_CONNECTOR.10 64.68,12.89 65.44,12.13 76.77,12.13 80.78,16.15 84.57,16.15 85.84,17.42 88.45,17.42 92.72,21.68 95.54,21.68 95.61,21.76
  Bottom 0.305: LS9.E 100.04,23.01 v99.3,22.27
LS10  (via drill 0.33)
  Top 0.305: R23.2 88.41,13.02 v87.84,13.02 87.72,12.89 86.67,12.89 85.65,13.92 C11.2 83.21,15 v81.26,15 | v62.11,19.68 62.14,19.7 LIGHT_SENSOR_CONNECTOR.11
  Bottom 0.305: LS10.E 88.54,13.72 v87.84,13.02 | v81.26,15 77.45,11.19 63.92,11.19 62.11,13 v62.11,19.68
LS11  (via drill 0.33)
  Top 0.305: R25.2 74.81,7.1 v74.81,7.46 74.56,7.71 73.47,7.71 72.08,9.1 C12.2 69.14,11.35 63.86,11.35 62.14,13.07 LIGHT_SENSOR_CONNECTOR.12
  Bottom 0.305: LS11.E 74.88,7.4 v74.81,7.46
LS12  (via drill 0.33)
  Top 0.305: R27.2 60.77,4.35 v60.77,5.07 60.77,5.2 C13.2 59.47,8.94 v59.47,10.51 | v59.65,19.52 59.6,19.58 LIGHT_SENSOR_CONNECTOR.13
  Bottom 0.305: LS12.E 60.91,4.93 v60.77,5.07 | v59.47,10.51 59.65,10.69 v59.65,19.52
LS13  (via drill 0.33)
  Top 0.305: R29.2 46.54,5.21 v46.54,6.6 44.66,8.48 C14.2 44.87,9.9 46.85,11.88 55.31,11.88 LIGHT_SENSOR_CONNECTOR.14
  Bottom 0.305: LS13.E 47.24,5.9 v46.54,6.6
LS14  (via drill 0.33)
  Top 0.305: R31.2 v33.46,11.68 32.4,12.74 C15.2 | R31.2 | v57.11,19.91 57.06,19.96 LIGHT_SENSOR_CONNECTOR.15
  Bottom 0.305: v33.46,11.68 34.57,10.57 LS14.E 37.51,10.57 38.9,11.96 55,11.96 55.48,12.44 55.89,12.44 57.11,13.66 v57.11,19.91
LS15  (via drill 0.33)
  Top 0.305: v21.9,20.03 21.9,18.92 R33.2 | C16.2 v21.9,20.03 | v21.9,20.03 | LIGHT_SENSOR_CONNECTOR.16 57.06,15.1 54.85,12.89 39.58,12.89 36.61,15.87 35.59,15.87 34.02,17.44 31.38,17.44 29.8,19.02 26.07,19.02 v25.38,18.33
  Bottom 0.305: v21.9,20.03 23.07,18.87 LS15.E 23.64,18.33 v25.38,18.33
LS16  (via drill 0.33)
  Top 0.305: R35.2 12.71,30.36 v12.71,31.21 13.32,31.82 13.32,33.04 13.86,33.58 C17.2 | v54.49,19.93 54.49,21.99 LIGHT_SENSOR_CONNECTOR.17
  Bottom 0.305: v12.71,31.21 13.69,30.23 LS16.E 13.42,29.32 13.42,24.12 14.31,23.23 14.31,22.9 15.45,21.76 15.45,21.43 17.59,19.3 17.59,19.07 19.75,16.91 20.2,16.91 21.4,15.71 24.88,15.71 29.07,19.91 33.46,19.91 39.66,13.71 53.88,13.71 54.52,14.34 54.52,19.91 v54.49,19.93
LS17  (via drill 0.33)
  Top 0.305: R37.2 6.77,43.91 v6.94,43.91 7.58,44.54 7.58,45.31 9.15,46.87 C18.2 | v32.01,18.84 34.81,18.84 39.91,13.73 53.88,13.73 54.42,14.27 54.42,16.07 LIGHT_SENSOR_CONNECTOR.18
  Bottom 0.305: v6.94,43.91 7.51,43.34 LS17.E 4.29,42.47 3.59,41.77 3.59,40.81 4.12,40.28 4.12,39.29 4.45,38.96 4.45,38.42 5.44,37.43 5.44,36.03 6.16,35.32 6.16,34.56 6.92,33.8 6.92,32.88 8.01,31.79 8.01,30.8 9.1,29.71 9.1,28.97 10.37,27.7 10.37,27.02 11.39,26 11.39,25.49 12.73,24.15 12.73,23.77 13.62,22.88 13.62,22.55 14.74,21.43 14.74,21.18 16.87,19.04 16.87,18.84 19.52,16.2 19.82,16.2 20.99,15.03 25.16,15.03 28.97,18.84 v32.01,18.84
LS18  (via drill 0.33)
  Top 0.305: R39.2 4.06,58.06 v4.96,58.06 7.71,60.8 C19.2 | v52.61,24.86 52.61,22.65 LIGHT_SENSOR_CONNECTOR.19
  Bottom 0.305: v4.96,58.06 4.95,58.04 LS18.E 9.05,52.33 9.05,50.08 9.66,49.47 9.66,47.74 10.04,47.36 10.04,46.14 10.47,45.71 10.47,44.59 11.03,44.04 11.03,42.84 11.54,42.33 11.54,41.09 12.25,40.38 12.25,39.39 12.96,38.68 12.96,38.27 13.52,37.71 13.52,37.08 14.16,36.44 14.16,35.68 14.64,35.2 14.64,34.84 15.2,34.28 15.2,33.67 15.86,33.01 15.86,32.91 16.37,32.4 16.37,32 17.13,31.23 17.13,31.18 17.66,30.65 17.66,30.19 18.86,29 18.86,28.69 23.05,24.5 23.43,24.5 24.27,23.66 26.78,23.66 28.94,21.51 32.72,21.51 34.88,23.66 51.42,23.66 v52.61,24.86
LS19  (via drill 0.33)
  Top 0.305: R41.2 5.1,72.41 v6.61,72.41 8.3,74.09 C20.2 | 52.05,16.25 LIGHT_SENSOR_CONNECTOR.20 51.93,16.22 v51.93,18.51
  Bottom 0.305: v6.61,72.41 6.04,71.84 LS19.E 6.04,69.47 6.82,68.7 8.04,68.7 9.25,67.48 9.25,55.01 9.61,54.65 9.61,52.47 9.81,52.26 9.81,50.26 10.35,49.72 10.35,48.12 10.73,47.74 10.73,46.47 11.21,45.99 11.21,44.95 11.69,44.47 11.69,43.32 12.2,42.82 12.2,41.47 12.99,40.68 12.99,39.69 13.62,39.06 13.62,38.6 14.16,38.07 14.16,37.41 14.82,36.75 14.82,36.11 15.35,35.58 15.35,35.04 15.88,34.51 15.88,34.05 16.52,33.42 16.52,33.34 17.08,32.78 17.08,32.3 17.76,31.61 17.76,31.39 18.42,30.73 18.42,30.34 19.49,29.28 19.49,29.05 23.38,25.16 23.96,25.16 24.6,24.53 27.42,24.53 29.73,22.22 32.29,22.22 34.5,24.43 50.83,24.43 52.36,25.95 53.35,25.95 53.93,25.37 53.93,24.12 51.93,22.12 v51.93,18.51
LS20  (via drill 0.33)
  Top 0.305: R43.2 10.19,85.49 v11.46,85.49 12.65,86.68 C21.2 16.09,86.68 19.06,89.64 v19.06,92.96 | LIGHT_SENSOR_CONNECTOR.21 49.44,25.24 v49.41,25.26
  Bottom 0.305: LS20.E 10.74,84.76 v11.46,85.49 | v19.06,92.96 20.15,91.86 20.15,89.2 18.02,87.06 18.02,86.38 16.14,84.5 16.14,83.23 14.82,81.91 14.82,80.54 14.08,79.8 14.08,78.88 13.22,78.02 13.22,76.83 12.68,76.29 12.68,75.12 12.07,74.52 12.07,73.19 11.62,72.74 11.62,71.44 11.19,71.01 11.19,69.66 10.55,69.03 10.55,66.57 9.99,66.01 9.99,55.29 10.3,54.98 10.3,52.77 10.55,52.52 10.55,50.49 11.01,50.03 11.01,48.4 11.44,47.97 11.44,46.88 11.9,46.42 11.9,45.2 12.4,44.7 12.4,43.6 12.86,43.15 12.86,41.77 13.67,40.96 13.67,39.97 14.31,39.34 14.31,38.93 14.84,38.4 14.84,37.69 15.45,37.08 15.45,36.52 16.04,35.93 16.04,35.37 16.62,34.79 16.62,34.38 17.21,33.8 17.21,33.65 17.74,33.11 17.74,32.71 18.4,32.05 18.4,31.79 19.16,31.03 19.16,30.6 20.13,29.63 20.13,29.3 23.56,25.87 23.99,25.87 24.72,25.14 27.67,25.14 29.85,22.95 31.94,22.95 34.22,25.24 49.39,25.24 v49.41,25.26
LS21  (via drill 0.33)
  Top 0.305: R45.2 19.22,96.74 v19.72,96.74 20.07,97.1 C22.2 25.03,96.08 v29.88,96.08 | LIGHT_SENSOR_CONNECTOR.22 49.44,18.51 48.17,19.78 44.15,19.78 41.51,17.14 37.7,17.14 35.32,19.52 34.83,19.52 33.69,20.67 33.69,22.8 32.45,24.05 v30.16,24.05
  Bottom 0.305: LS21.E 18.88,95.9 v19.72,96.74 | v29.88,96.08 26.98,93.18 24.47,93.18 20.86,89.58 20.86,88.92 18.73,86.78 18.73,86.05 16.87,84.19 16.87,82.92 15.55,81.6 15.55,80.23 14.79,79.47 14.79,78.55 13.95,77.72 13.95,76.52 13.37,75.94 13.37,74.82 12.79,74.24 12.79,72.89 12.38,72.48 12.38,71.24 11.92,70.78 11.92,69.44 11.26,68.77 11.26,66.29 10.7,65.73 10.7,55.54 11.01,55.24 11.01,53.05 11.29,52.77 11.29,50.82 11.74,50.36 11.74,48.66 12.2,48.2 12.2,47.13 12.63,46.7 12.63,45.48 13.14,44.98 13.14,43.86 13.62,43.37 13.62,42 14.36,41.27 14.36,40.4 14.97,39.79 14.97,39.29 15.5,38.75 15.5,37.96 16.19,37.28 16.19,36.8 16.8,36.19 16.8,35.68 17.38,35.09 17.38,34.71 17.92,34.18 17.92,33.95 18.45,33.42 18.45,33.04 19.14,32.35 19.14,31.89 19.9,31.13 19.9,30.8 20.81,29.89 20.81,29.61 23.83,26.59 24.29,26.59 25.05,25.82 28.38,25.82 v30.16,24.05
LS22  (via drill 0.33)
  Top 0.305: 29.73,106.62 R47.2 30.89,105.91 v31.1,105.91 33.6,105.91 C23.2 35.7,103.81 35.7,100.68 33.23,98.21 33.23,95.14 31.91,93.82 24.14,93.82 20.13,89.81 20.13,89.12 18.02,87.01 18.02,86.4 16.14,84.52 16.14,83.2 14.84,81.91 14.84,80.56 14.06,79.77 14.06,78.83 13.24,78.02 13.24,76.78 12.71,76.24 12.71,75.12 12.1,74.52 12.1,73.19 11.67,72.76 11.67,71.52 11.21,71.06 11.21,69.66 10.58,69.03 10.58,66.62 9.99,66.03 9.99,55.26 10.27,54.98 10.27,52.8 10.58,52.49 10.58,50.54 10.98,50.13 10.98,48.4 11.44,47.95 11.44,46.88 11.9,46.42 11.9,45.25 12.38,44.77 12.38,43.6 12.89,43.1 12.89,41.75 13.67,40.96 13.67,40.02 14.28,39.41 14.28,38.96 14.84,38.4 14.84,37.69 15.43,37.1 15.43,36.52 16.06,35.88 16.06,35.37 16.62,34.82 16.62,34.38 17.21,33.8 17.21,33.65 17.74,33.11 17.74,32.71 18.4,32.05 18.4,31.77 19.19,30.98 19.19,30.57 20.13,29.63 20.13,29.33 23.58,25.87 23.96,25.87 24.65,25.19 37.98,25.19 39.13,24.05 39.13,22.22 40.27,21.07 41.21,21.07 42.27,22.14 42.27,24.93 43.04,25.7 46.01,25.7 46.9,24.81 LIGHT_SENSOR_CONNECTOR.23
  Bottom 0.305: LS22.E 30.38,105.19 v31.1,105.91
LS23  (via drill 0.33)
  Top 0.305: R49.2 44.18,111.88 v44.18,111.4 44.26,111.32 45.78,111.32 47.27,109.83 C24.2 47.36,95.15 45.35,93.13 24.47,93.13 20.86,89.53 20.86,88.89 18.73,86.76 18.73,86.07 16.85,84.19 16.85,82.9 15.58,81.63 15.58,80.23 14.79,79.44 14.79,78.53 13.95,77.69 13.95,76.5 13.4,75.94 13.4,74.85 12.79,74.24 12.79,72.89 12.35,72.46 12.35,71.24 11.9,70.78 11.9,69.41 11.29,68.8 11.29,66.31 10.7,65.73 10.7,55.52 11.01,55.21 11.01,53.08 11.31,52.77 11.31,50.79 11.72,50.39 11.72,48.68 12.18,48.23 12.18,47.13 12.61,46.7 12.61,45.51 13.12,45 13.12,43.88 13.62,43.37 13.62,42.03 14.39,41.27 14.39,40.43 14.97,39.84 14.97,39.23 15.53,38.68 15.53,37.99 16.19,37.33 16.19,36.8 16.8,36.19 16.8,35.7 17.38,35.12 17.38,34.69 17.89,34.18 17.89,33.93 18.45,33.37 18.45,33.04 19.16,32.33 19.16,31.89 19.9,31.16 19.9,30.83 20.81,29.91 20.81,29.63 23.89,26.56 24.27,26.56 24.98,25.85 40.01,25.85 41,24.86 v41,22.67 | v46.87,18.51 46.87,16.2 LIGHT_SENSOR_CONNECTOR.24
  Bottom 0.305: LS23.E 44.14,111.36 v44.18,111.4 | v41,22.67 41,22.01 43.52,19.5 45.88,19.5 v46.87,18.51
N$1  (via drill 0.33)
  Top 0.305: R2.1 60.28,117 v60.28,117.06
  Bottom 0.305: v60.28,117.06 60.28,113.61 61.36,112.53 LED0.A
N$2  (via drill 0.33)
  Top 0.305: v74.46,113.94 75.3,113.94 R4.1
  Bottom 0.305: LED1.A 76.01,110.14 74.81,111.35 74.81,113.58 v74.46,113.94
N$3  (via drill 0.33)
  Top 0.305: v87.61,101.41 88.12,101.41 89.24,102.53 89.24,106.99 R6.1
  Bottom 0.305: LED2.A 88.38,102.18 v87.61,101.41
N$4  (via drill 0.33)
  Top 0.305: R8.1 100.36,97.91 v100.36,99.41
  Bottom 0.305: 100.08,99.12 v100.36,99.41 99.05,98.09 LED3.A
N$5  (via drill 0.33)
  Top 0.305: v108.01,86.89 109.15,85.74 R10.1
  Bottom 0.305: LED4.A 106.77,83.33 106.77,85.64 v108.01,86.89
N$6  (via drill 0.33)
  Top 0.305: R12.1 113.34,73.19 v113.34,73.55
  Bottom 0.305: LED5.A 111.16,71.39 113.32,73.55 v113.34,73.55
N$7  (via drill 0.33)
  Top 0.305: R14.1 116.16,57.94 v116.16,58.95
  Bottom 0.305: 112.14,56.57 LED6.A 114.96,58.95 v116.16,58.95
N$8  (via drill 0.33)
  Top 0.305: v113.6,44.77 113.6,43.54 R16.1
  Bottom 0.305: LED7.A 109.68,42.94 111.13,44.39 113.22,44.39 v113.6,44.77
N$9  (via drill 0.33)
  Top 0.305: 107.01,29.96 R18.1 107.01,30.96 v106.66,31.31
  Bottom 0.305: LED8.A 104.78,31.31 v106.66,31.31
N$10  (via drill 0.33)
  Top 0.305: R20.1 98.27,18.45 v98.99,19.17
  Bottom 0.305: LED9.A 98.34,19.83 v98.99,19.17
N$11  (via drill 0.33)
  Top 0.305: v87.66,10.2 85.89,10.2 R22.1
  Bottom 0.305: LED10.A 85.23,12.23 85.76,11.7 86.17,11.7 v87.66,10.2
N$12  (via drill 0.33)
  Top 0.305: v73.34,4.97 73.23,4.86 R24.1
  Bottom 0.305: LED11.A 70.93,7.13 71.99,7.13 73.34,5.78 v73.34,4.97
N$13  (via drill 0.33)
  Top 0.305: v58,5.48 58,4.32 R26.1
  Bottom 0.305: LED12.A 56.85,6.63 v58,5.48
N$14  (via drill 0.41)
  Top 0.305: v42.96,4.34 v42.97,4.34 R28.1
  Bottom 0.305: LED13.A 44.56,7.23 44.56,5.17 43.72,4.34 v42.96,4.34
N$15  (via drill 0.33)
  Top 0.305: R30.1 30.13,12.01 v30.87,11.27
  Bottom 0.305: v30.87,11.27 30.87,14.89 LED14.A
N$16  (via drill 0.33)
  Top 0.305: v20.38,22.19 19.14,22.19 R32.1
  Bottom 0.305: LED15.A 20.11,22.46 v20.38,22.19
N$17  (via drill 0.33)
  Top 0.305: R34.1 10.02,33.18 v10.02,31.69
  Bottom 0.305: LED16.A 12.07,35.5 12.07,33.75 v10.02,31.69
N$18  (via drill 0.33)
  Top 0.305: R36.1 4.65,45.9 v4.99,45.56
  Bottom 0.305: LED17.A 7.83,47.64 5.75,45.56 v4.99,45.56
N$19  (via drill 0.33)
  Top 0.305: R38.1 2.14,60.41 v2.14,60.16
  Bottom 0.305: 6.65,62.36 LED18.A 4.06,60.16 v2.14,60.16
N$20  (via drill 0.33)
  Top 0.305: v5.06,74.64 5.68,75.26 R40.1
  Bottom 0.305: LED19.A 7.61,74.64 v5.06,74.64
N$21  (via drill 0.33)
  Top 0.305: v10.96,88.36 11.98,89.38 R42.1
  Bottom 0.305: LED20.A 14.17,87.32 12.63,87.32 11.59,88.36 v10.96,88.36
N$22  (via drill 0.33)
  Top 0.305: v19.77,100.09 20.31,100.64 R44.1
  Bottom 0.305: LED21.A 23.37,98.44 21.6,98.44 19.95,100.09 v19.77,100.09
N$23  (via drill 0.33)
  Top 0.305: v31.4,109.36 32.9,108.68 R46.1
  Bottom 0.305: LED22.A 33.33,106.78 v31.4,109.36
N$24  (via drill 0.33)
  Top 0.305: v45.53,113.91 46.73,113.91 R48.1
  Bottom 0.305: LED23.A 46.82,111.3 45.3,112.82 45.3,113.68 v45.53,113.91

### Text on the board
tPlace: LJ STAND | Lachan Grant | James Yelland | James Wallington | Sam Tudor | Nakul Doshi | Designed by James Yelland | 1 | AUSTRALIA | BRISBANE BOYS' COLLEGE